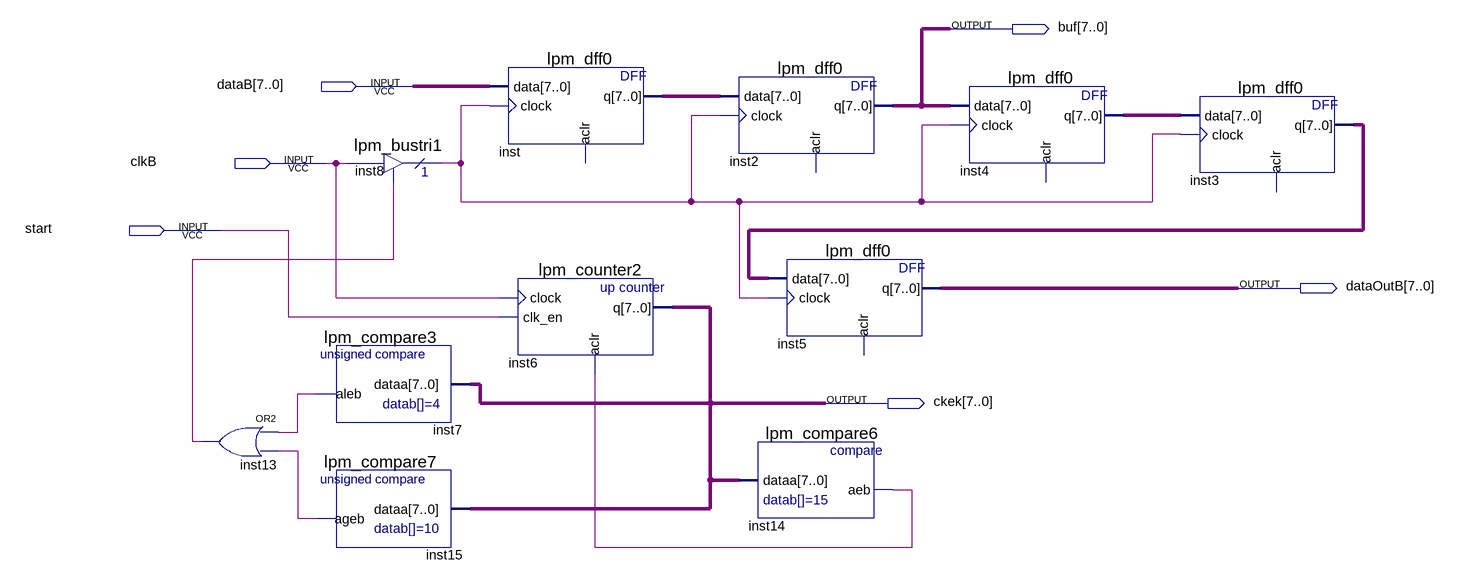
[diagram p0: schematic sheet]
// Quartus schematic Buffer.bdf as structural Verilog: 11 symbols, 6 pins
module Buffer (
  input  [7:0] dataB,
  input  clkB,
  input  start,
  output [7:0] \buf ,
  output [7:0] dataOutB,
  output [7:0] ckek
);

  wire inst7_aleb, inst8_tridata, inst13_out, inst14_aeb, inst15_ageb;
  wire [7:0] inst3_q, inst4_q, inst_q;

  or inst13 (inst13_out, inst7_aleb, inst15_ageb);
  lpm_bustri1 inst8 (.enabledt(inst13_out), .data(clkB), .tridata(inst8_tridata));
  lpm_compare3 inst7 (.dataa(ckek), .aleb(inst7_aleb));
  lpm_compare7 inst15 (.dataa(ckek), .ageb(inst15_ageb));
  lpm_dff0 inst (.data(dataB), .clock(inst8_tridata), .q(inst_q));  // open: aclr
  lpm_counter2 inst6 (.clock(clkB), .clk_en(start), .aclr(inst14_aeb), .q(ckek));
  lpm_dff0 inst2 (.data(inst_q), .clock(inst8_tridata), .q(\buf ));  // open: aclr
  lpm_compare6 inst14 (.dataa(ckek), .aeb(inst14_aeb));
  lpm_dff0 inst5 (.data(inst3_q), .clock(inst8_tridata), .q(dataOutB));  // open: aclr
  lpm_dff0 inst4 (.data(\buf ), .clock(inst8_tridata), .q(inst4_q));  // open: aclr
  lpm_dff0 inst3 (.data(inst4_q), .clock(inst8_tridata), .q(inst3_q));  // open: aclr
endmodule
